# Altium schematic sheet Base.SchDoc: Sistema Elétrico IC Champagnat Racing PUCPR
size A3; DocumentNumber: 1; Revision: v1.0.0; SheetNumber: 1; SheetTotal: 1
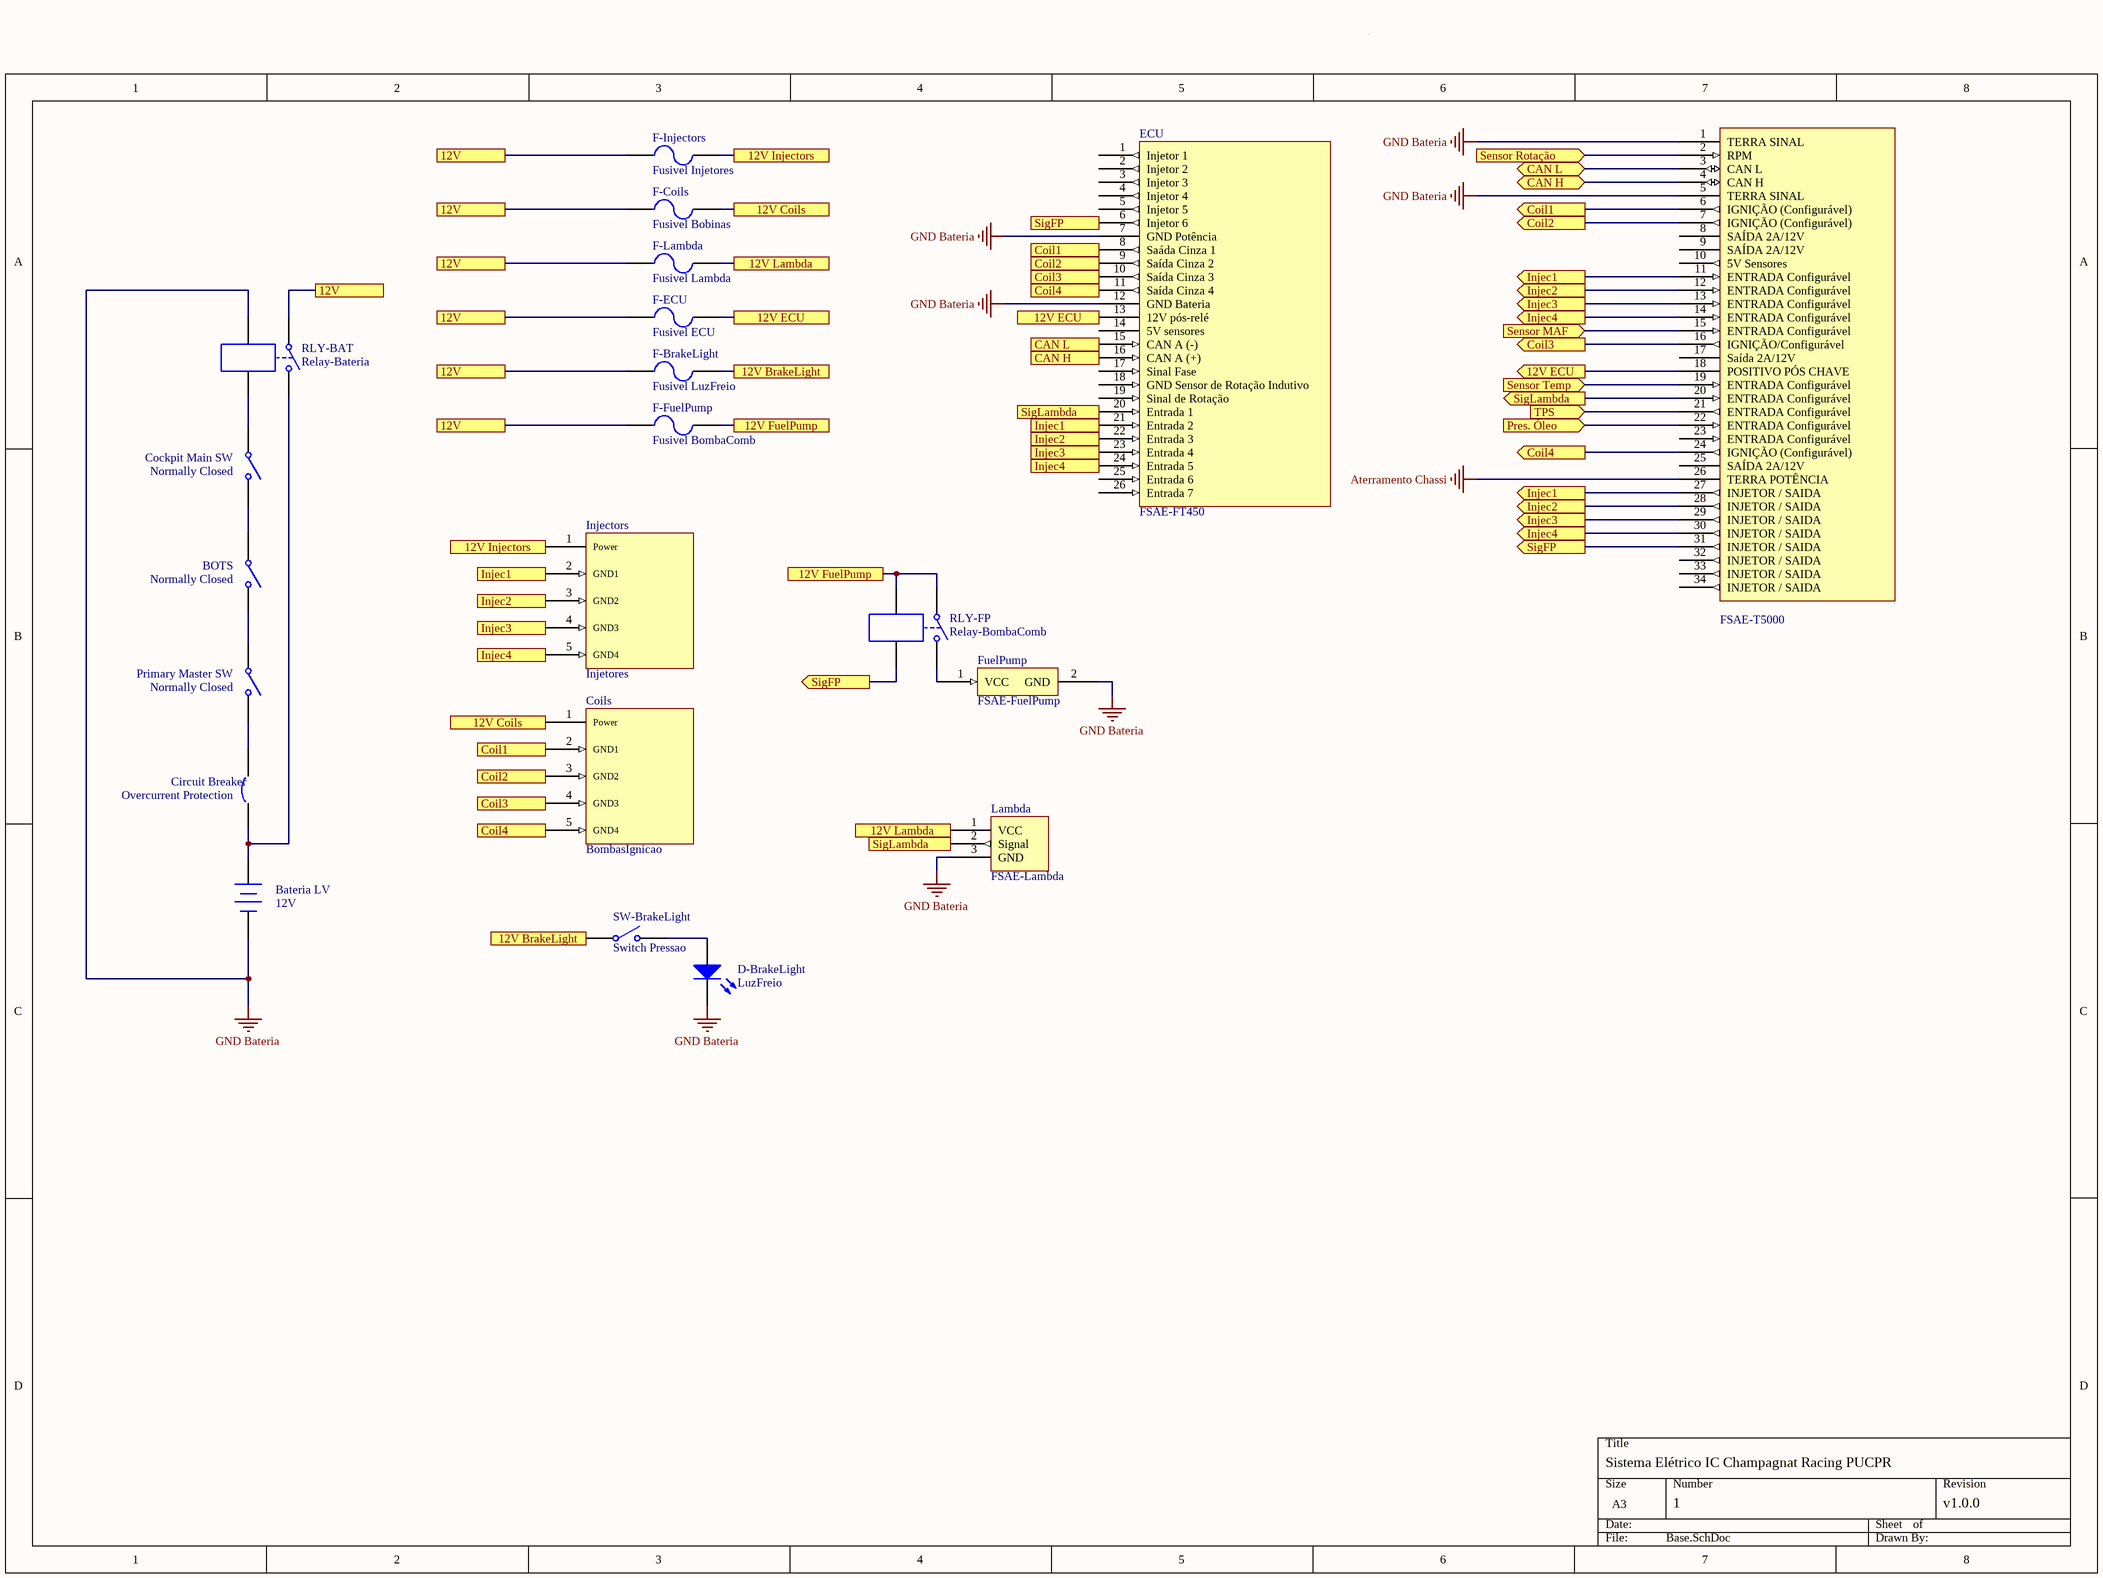
[diagram p0: Base.SchDoc]

## Parts
?  FSAE-T5000
Bateria_LV  12V  [BAT-2]
BOTS  Normally Closed  [SPST-2]
Circuit_Breaker  Overcurrent Protection  [SPST-2]
Cockpit_Main_SW  Normally Closed  [SPST-2]
Coils  BombasIgnicao
D-BrakeLight  LuzFreio  [LED-1]
ECU  FSAE-FT450
F-BrakeLight  Fusivel LuzFreio  [PIN-W2/E2.8]
F-Coils  Fusivel Bobinas  [PIN-W2/E2.8]
F-ECU  Fusivel ECU  [PIN-W2/E2.8]
F-FuelPump  Fusivel BombaComb  [PIN-W2/E2.8]
F-Injectors  Fusivel Injetores  [PIN-W2/E2.8]
F-Lambda  Fusivel Lambda  [PIN-W2/E2.8]
FuelPump  FSAE-FuelPump
Injectors  Injetores
Lambda  FSAE-Lambda
Primary_Master_SW  Normally Closed  [SPST-2]  (mechanical)
RLY-BAT  Relay-Bateria  [MODULE4]
RLY-FP  Relay-BombaComb  [MODULE4]
SW-BrakeLight  Switch Pressao  [SPST-2]

## Ports
12V, 12V BrakeLight, 12V Coils, 12V ECU, 12V ECU (out), 12V FuelPump, 12V Injectors, 12V Lambda, CAN H (bidir), CAN H (in), CAN L (bidir), CAN L (in), Coil1 (out), Coil2 (out), Coil3 (out), Coil4 (out), Injec1 (out), Injec2 (out), Injec3 (out), Injec4 (out), Pres. Óleo (in), Sensor MAF (in), Sensor Rotação (in), Sensor Temp (in), SigFP (out), SigLambda (out), TPS (in)

## Nets
Aterramento Chassi: ?.26(TERRA_POTÊNCIA)
GND Bateria: ?.1(TERRA_SINAL) ?.5(TERRA_SINAL) Bateria_LV.2(-) D-BrakeLight.2(K) ECU.7(GND_Potência) ECU.12(GND_Bateria) FuelPump.2(GND) Lambda.3(GND) RLY-BAT.3
12V: F-BrakeLight.1 F-Coils.1 F-ECU.1 F-FuelPump.1 F-Injectors.1 F-Lambda.1 RLY-BAT.1 ; port 12V
12V BrakeLight: F-BrakeLight.2 SW-BrakeLight.1(COMMON) ; port 12V BrakeLight
12V Coils: Coils.1(Power) F-Coils.2 ; port 12V Coils
12V ECU: ?.18(POSITIVO_PÓS_CHAVE) ECU.13(12V_pós-relé) F-ECU.2 ; port 12V ECU
12V FuelPump: F-FuelPump.2 RLY-FP.1 RLY-FP.3 ; port 12V FuelPump
12V Injectors: F-Injectors.2 Injectors.1(Power) ; port 12V Injectors
12V Lambda: F-Lambda.2 Lambda.1(VCC) ; port 12V Lambda
CAN H: ?.4(CAN_H) ECU.16(CAN_A_(+)) ; port CAN H
CAN L: ?.3(CAN_L) ECU.15(CAN_A_(-)) ; port CAN L
Coil1: ?.6(IGNIÇÃO_(Configurável)) Coils.2(GND1) ECU.8(Saáda_Cinza_1) ; port Coil1
Coil2: ?.7(IGNIÇÃO_(Configurável)) Coils.3(GND2) ECU.9(Saída_Cinza_2) ; port Coil2
Coil3: ?.16(IGNIÇÃO/Configurável) Coils.4(GND3) ECU.10(Saída_Cinza_3) ; port Coil3
Coil4: ?.24(IGNIÇÃO_(Configurável)) Coils.5(GND4) ECU.11(Saída_Cinza_4) ; port Coil4
Injec1: ?.11(ENTRADA_Configurável) ?.27(INJETOR_/_SAIDA) ECU.21(Entrada_2) Injectors.2(GND1) ; port Injec1
Injec2: ?.12(ENTRADA_Configurável) ?.28(INJETOR_/_SAIDA) ECU.22(Entrada_3) Injectors.3(GND2) ; port Injec2
Injec3: ?.13(ENTRADA_Configurável) ?.29(INJETOR_/_SAIDA) ECU.23(Entrada_4) Injectors.4(GND3) ; port Injec3
Injec4: ?.14(ENTRADA_Configurável) ?.30(INJETOR_/_SAIDA) ECU.24(Entrada_5) Injectors.5(GND4) ; port Injec4
Pres. Óleo: ?.22(ENTRADA_Configurável) ; port Pres. Óleo
Sensor MAF: ?.15(ENTRADA_Configurável) ; port Sensor MAF
Sensor Rotação: ?.2(RPM) ; port Sensor Rotação
Sensor Temp: ?.19(ENTRADA_Configurável) ; port Sensor Temp
SigFP: ?.31(INJETOR_/_SAIDA) ECU.6(Injetor_6) RLY-FP.4 ; port SigFP
SigLambda: ?.20(ENTRADA_Configurável) ECU.20(Entrada_1) Lambda.2(Signal) ; port SigLambda
TPS: ?.21(ENTRADA_Configurável) ; port TPS
NetBateria_LV_1: Bateria_LV.1(+) Circuit_Breaker.1 RLY-BAT.2
NetBOTS_1: BOTS.1(COMMON) Cockpit_Main_SW.2(NO)
NetBOTS_2: BOTS.2(NO) Primary_Master_SW.1(COMMON)
NetCircuit_Breaker_2: Circuit_Breaker.2 Primary_Master_SW.2(NO)
NetCockpit_Main_SW_1: Cockpit_Main_SW.1(COMMON) RLY-BAT.4
NetD-BrakeLight_1: D-BrakeLight.1(A) SW-BrakeLight.2(NO)
NetFuelPump_1: FuelPump.1(VCC) RLY-FP.2

Not connected (* = marked no-connect by the designer): ? 8(SAÍDA_2A/12V) 9(SAÍDA_2A/12V) 10(5V_Sensores) 17(Saída_2A/12V) 23(ENTRADA_Configurável) 25(SAÍDA_2A/12V) 32(INJETOR_/_SAIDA) 33(INJETOR_/_SAIDA) 34(INJETOR_/_SAIDA); ECU 1(Injetor_1) 2(Injetor_2) 3(Injetor_3) 4(Injetor_4) 5(Injetor_5) 14(5V_sensores) 17(Sinal_Fase) 18(GND_Sensor_de_Rotação_Indutivo) 19(Sinal_de_Rotação) 25(Entrada_6) 26(Entrada_7)

## Library data of the parts
? = ECU
Bateria_LV = Battery: Multicell Battery; Published: 24-Mar-1999; LatestRevisionDate: 17-Jul-2002; LatestRevisionNote: Re-released for DXP Platform.; PackageReference: BAT-2; Publisher: Altium Limited; PackageDescription: Battery; 2 Leads
BOTS SW-BrakeLight = SW-SPST: Single-Pole, Single-Throw Switch; Published: 24-Mar-1999; LatestRevisionDate: 17-Jul-2002; LatestRevisionNote: Re-released for DXP Platform.; PackageReference: SPST-2; Publisher: Altium Limited; PackageDescription: Switch; 2 Leads
Circuit_Breaker = Circuit Breaker: Overcurrent Protection 100A; Published: 24-Mar-1999; LatestRevisionDate: 17-Jul-2002; LatestRevisionNote: Re-released for DXP Platform.; PackageReference: SPST-2; Publisher: Altium Limited; PackageDescription: Switch; 2 Leads
Cockpit_Main_SW = SW-SPST: Push-rotate emergency switch; Push = OFF. Must act through a relay; Published: 24-Mar-1999; LatestRevisionDate: 17-Jul-2002; LatestRevisionNote: Re-released for DXP Platform.; PackageReference: SPST-2; Publisher: Altium Limited; PackageDescription: Switch; 2 Leads
Coils Injectors = CMP-003-000000-2: General purpose component to be used as injectors and coils; Design Item ID: FSAE VCC + 4x GND; Source: 1.SchLib
D-BrakeLight = LED1: Typical RED GaAs LED; Published: 8-Jun-2000; LatestRevisionDate: 08-Jul-2005; LatestRevisionNote: Mech Layer 1 removed.; PackageReference: LED-1; Publisher: Altium Limited; PackageDescription: LED; 2 Leads
ECU = CMP-001-0000-1: Pinout ECU FT450
F-BrakeLight F-Coils F-ECU F-FuelPump F-Injectors F-Lambda = Fuse 2: Fuse; Published: 8-Jun-2000; LatestRevisionDate: 17-Jul-2002; LatestRevisionNote: Re-released for DXP Platform.; PackageReference: PIN-W2/E2.8; Publisher: Altium Limited; PackageDescription: Thru-Hole; 2 Leads
FuelPump = CMP-001-0001-2: General purpose Vcc + GND
Lambda = CMP-001-0002-1: General Purpose 1xVCC 1xSignal 1xGND
Primary_Master_SW = SW-SPST: Rotary mechanical switch. Must be direct acting (no relay or logic); Published: 24-Mar-1999; LatestRevisionDate: 17-Jul-2002; LatestRevisionNote: Re-released for DXP Platform.; PackageReference: SPST-2; Publisher: Altium Limited; PackageDescription: Switch; 2 Leads
RLY-BAT RLY-FP = Relay-SPST: Single-Pole Single-Throw Relay; Published: 24-Mar-1999; LatestRevisionDate: 17-Jul-2002; LatestRevisionNote: Re-released for DXP Platform.; PackageReference: MODULE4; Publisher: Altium Limited